# EAGLE design 3xCV (EAGLE 7.1.0)
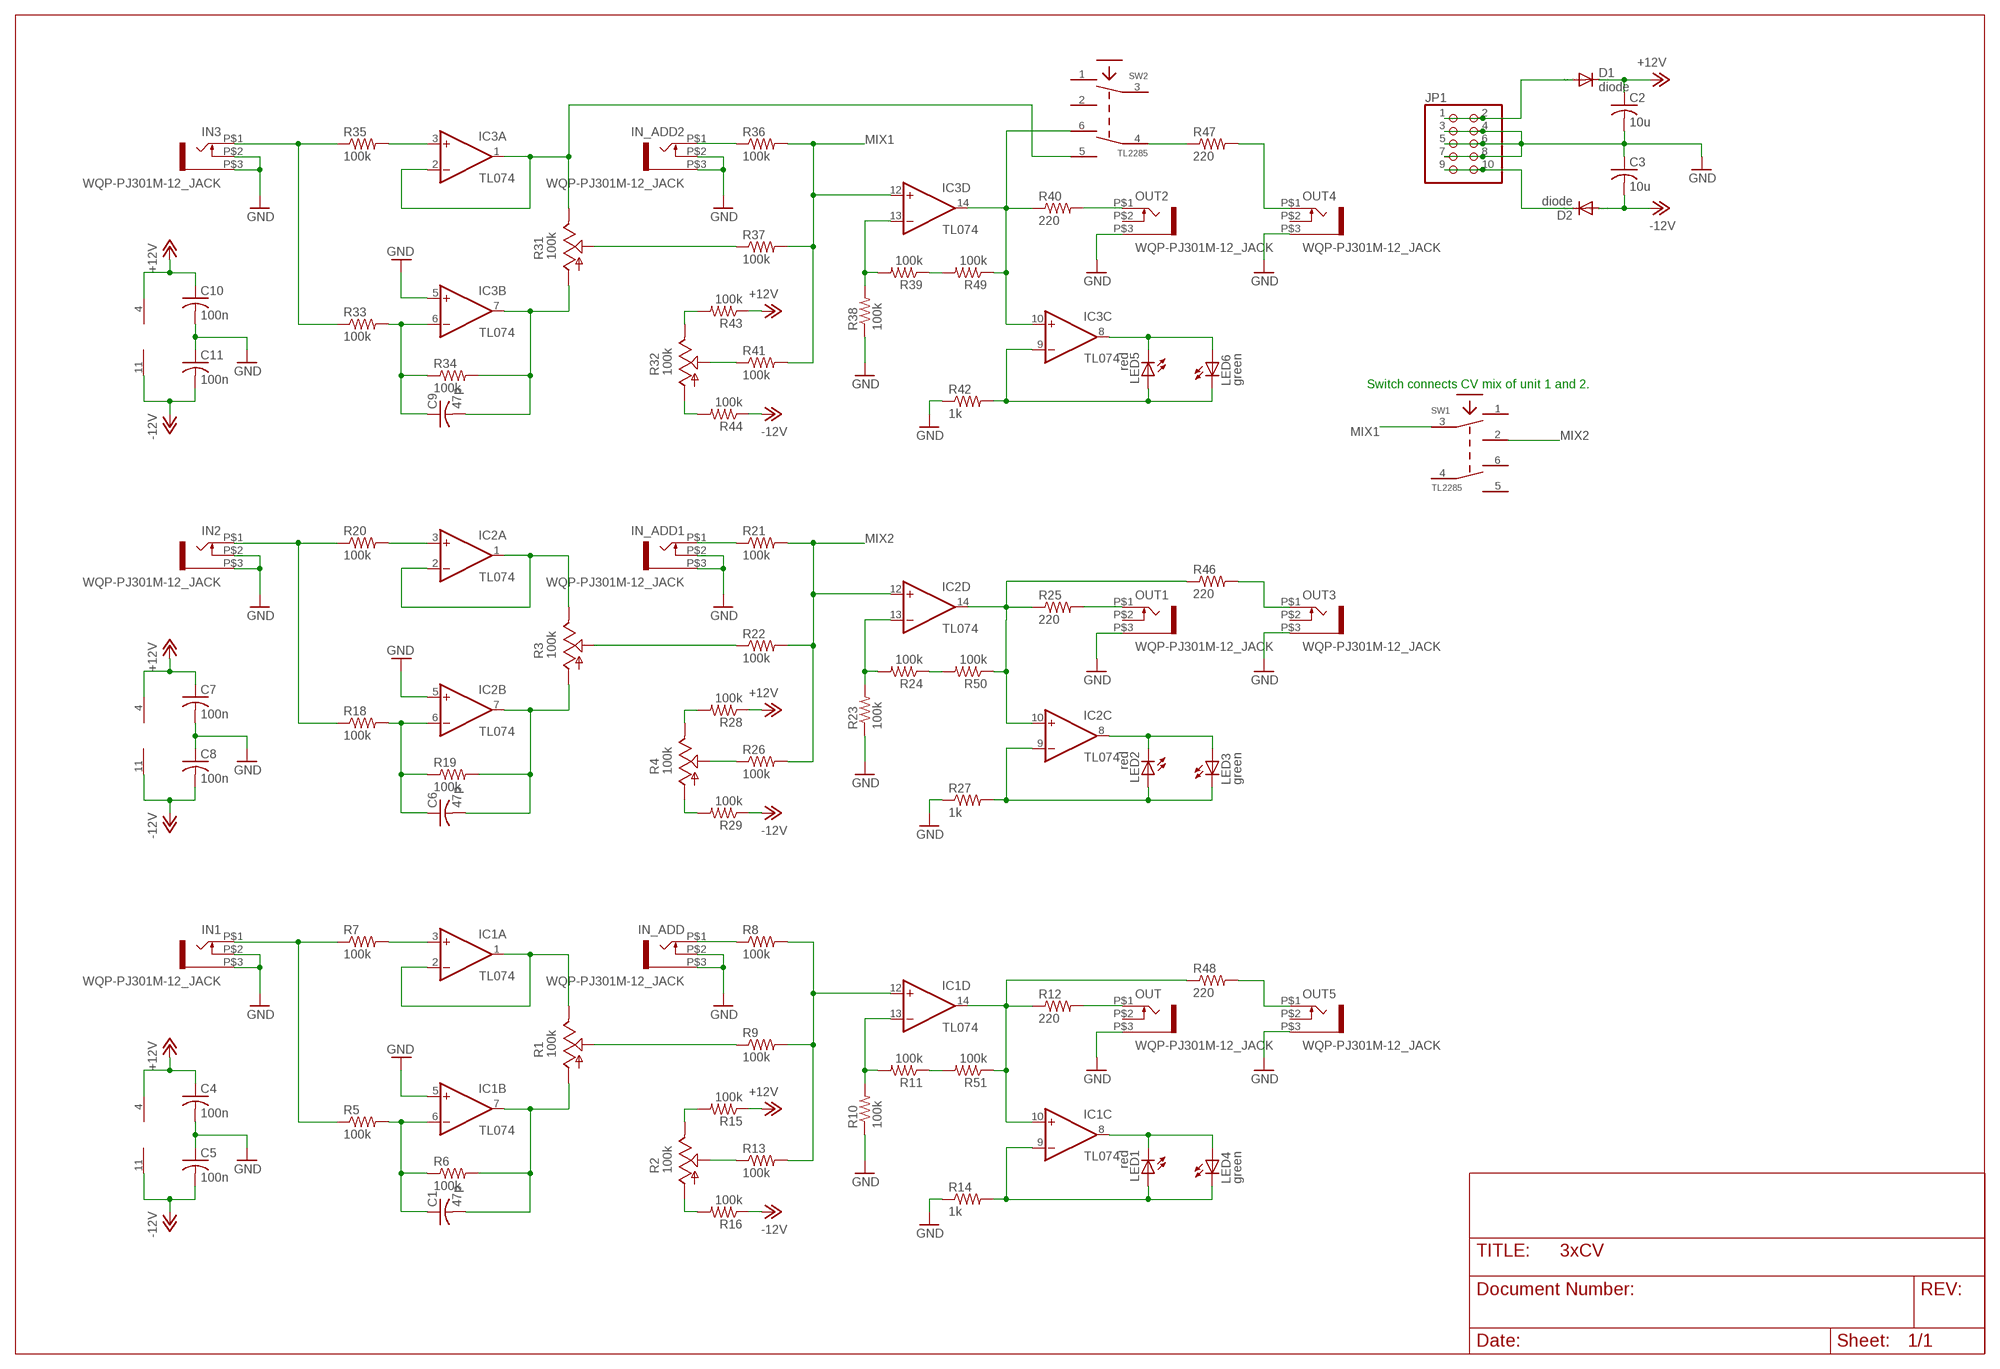
[diagram p0: schematic, sheet 1]

## Parts
C1  47p  C-USC0603  [C0603]
C2  10u  C-USC1206  [C1206]
C3  10u  C-USC1206  [C1206]
C4  100n  C-USC0603  [C0603]
C5  100n  C-USC0603  [C0603]
C6  47p  C-USC0603  [C0603]
C7  100n  C-USC0603  [C0603]
C8  100n  C-USC0603  [C0603]
C9  47p  C-USC0603  [C0603]
C10  100n  C-USC0603  [C0603]
C11  100n  C-USC0603  [C0603]
D1  diode  DIODE-DO214AA  [DO214AA]
D2  diode  DIODE-DO214AA  [DO214AA]
IC1  TL074  LM324D  [SO14]
IC2  TL074  LM324D  [SO14]
IC3  TL074  LM324D  [SO14]
IN1  WQP-PJ301M-12_JACK  [WQP-PJ301M-12_JACK]
IN2  WQP-PJ301M-12_JACK  [WQP-PJ301M-12_JACK]
IN3  WQP-PJ301M-12_JACK  [WQP-PJ301M-12_JACK]
IN_ADD  WQP-PJ301M-12_JACK  [WQP-PJ301M-12_JACK]
IN_ADD1  WQP-PJ301M-12_JACK  [WQP-PJ301M-12_JACK]
IN_ADD2  WQP-PJ301M-12_JACK  [WQP-PJ301M-12_JACK]
JP1  PINHD-2X5  [2X05]
LED1  red  LED3MM  [LED3MM]
LED2  red  LED3MM  [LED3MM]
LED3  green  LED3MM  [LED3MM]
LED4  green  LED3MM  [LED3MM]
LED5  red  LED3MM  [LED3MM]
LED6  green  LED3MM  [LED3MM]
OUT  WQP-PJ301M-12_JACK  [WQP-PJ301M-12_JACK]
OUT1  WQP-PJ301M-12_JACK  [WQP-PJ301M-12_JACK]
OUT2  WQP-PJ301M-12_JACK  [WQP-PJ301M-12_JACK]
OUT3  WQP-PJ301M-12_JACK  [WQP-PJ301M-12_JACK]
OUT4  WQP-PJ301M-12_JACK  [WQP-PJ301M-12_JACK]
OUT5  WQP-PJ301M-12_JACK  [WQP-PJ301M-12_JACK]
R1  100k  POT_USVERTICAL  [ALPS_POT_VERTICAL]
R2  100k  POT_USVERTICAL  [ALPS_POT_VERTICAL]
R3  100k  POT_USVERTICAL  [ALPS_POT_VERTICAL]
R4  100k  POT_USVERTICAL  [ALPS_POT_VERTICAL]
R5  100k  R-US_R0603  [R0603]
R6  100k  R-US_R0603  [R0603]
R7  100k  R-US_R0603  [R0603]
R8  100k  R-US_R0603  [R0603]
R9  100k  R-US_R0603  [R0603]
R10  100k  R-US_R0603  [R0603]
R11  100k  R-US_R0603  [R0603]
R12  220  R-US_R0603  [R0603]
R13  100k  R-US_R0603  [R0603]
R14  1k  R-US_R0603  [R0603]
R15  100k  R-US_R0603  [R0603]
R16  100k  R-US_R0603  [R0603]
R18  100k  R-US_R0603  [R0603]
R19  100k  R-US_R0603  [R0603]
R20  100k  R-US_R0603  [R0603]
R21  100k  R-US_R0603  [R0603]
R22  100k  R-US_R0603  [R0603]
R23  100k  R-US_R0603  [R0603]
R24  100k  R-US_R0603  [R0603]
R25  220  R-US_R0603  [R0603]
R26  100k  R-US_R0603  [R0603]
R27  1k  R-US_R0603  [R0603]
R28  100k  R-US_R0603  [R0603]
R29  100k  R-US_R0603  [R0603]
R31  100k  POT_USVERTICAL  [ALPS_POT_VERTICAL]
R32  100k  POT_USVERTICAL  [ALPS_POT_VERTICAL]
R33  100k  R-US_R0603  [R0603]
R34  100k  R-US_R0603  [R0603]
R35  100k  R-US_R0603  [R0603]
R36  100k  R-US_R0603  [R0603]
R37  100k  R-US_R0603  [R0603]
R38  100k  R-US_R0603  [R0603]
R39  100k  R-US_R0603  [R0603]
R40  220  R-US_R0603  [R0603]
R41  100k  R-US_R0603  [R0603]
R42  1k  R-US_R0603  [R0603]
R43  100k  R-US_R0603  [R0603]
R44  100k  R-US_R0603  [R0603]
R46  220  R-US_R0603  [R0603]
R47  220  R-US_R0603  [R0603]
R48  220  R-US_R0603  [R0603]
R49  100k  R-US_R0603  [R0603]
R50  100k  R-US_R0603  [R0603]
R51  100k  R-US_R0603  [R0603]
SW1  TL2285  [TL2285_PCB]
SW2  TL2285  [TL2285_PCB]

## Nets
+12V: C2.1 C4.1 C7.1 C10.1 D1.C IC1.4(P:V+) IC2.4(P:V+) IC3.4(P:V+) R15.1 R28.1 R43.1
-12V: C3.2 C5.2 C8.2 C11.2 D2.A IC1.11(P:V-) IC2.11(P:V-) IC3.11(P:V-) R16.1 R29.1 R44.1
GND: C2.2 C3.1 C4.2 C5.1 C7.2 C8.1 C10.2 C11.1 IC1.5(B:+IN) IC2.5(B:+IN) IC3.5(B:+IN) IN1.P$2 IN1.P$3 IN2.P$2 IN2.P$3 IN3.P$2 IN3.P$3 IN_ADD1.P$2 IN_ADD1.P$3 IN_ADD2.P$2 IN_ADD2.P$3 IN_ADD.P$2 IN_ADD.P$3 JP1.3 JP1.4 JP1.5 JP1.6 JP1.7 JP1.8 OUT1.P$3 OUT2.P$3 OUT3.P$3 OUT4.P$3 OUT5.P$3 OUT.P$3 R10.1 R14.1 R23.1 R27.1 R38.1 R42.1
MIX1: IC3.12(D:+IN) R36.2 R37.2 R41.2 SW1.3
MIX2: IC2.12(D:+IN) R21.2 R22.2 R26.2 SW1.2
N$1: IC1.9(C:-IN) LED1.A LED4.K(C) R14.2
N$2: IN1.P$1 R5.1 R7.1
N$3: C1.1 IC1.6(B:-IN) R5.2 R6.1
N$4: IC1.3(A:+IN) R7.2
N$5: IC1.1(A:OUT) IC1.2(A:-IN) R1.P$1(E)
N$6: OUT.P$1 R12.2
N$7: C1.2 IC1.7(B:OUT) R1.P$3(A) R6.2
N$8: R2.P$2(S) R13.1
N$9: R1.P$2(S) R9.1
N$10: IN_ADD.P$1 R8.1
N$11: IC1.8(C:OUT) LED1.K(C) LED4.A
N$12: IC1.12(D:+IN) R8.2 R9.2 R13.2
N$13: IC1.10(C:+IN) IC1.14(D:OUT) R12.1 R48.1 R51.1
N$14: IC1.13(D:-IN) R10.2 R11.2
N$15: R2.P$1(E) R15.2
N$16: R2.P$3(A) R16.2
N$17: D2.C JP1.9 JP1.10
N$18: R47.1 SW2.4
N$19: OUT3.P$1 R46.2
N$20: D1.A JP1.1 JP1.2
N$21: OUT4.P$1 R47.2
N$22: IN2.P$1 R18.1 R20.1
N$23: C6.1 IC2.6(B:-IN) R18.2 R19.1
N$24: IC2.3(A:+IN) R20.2
N$25: IC2.1(A:OUT) IC2.2(A:-IN) R3.P$1(E)
N$26: C6.2 IC2.7(B:OUT) R3.P$3(A) R19.2
N$27: R3.P$2(S) R22.1
N$28: IN_ADD1.P$1 R21.1
N$31: IC2.13(D:-IN) R23.2 R24.2
N$32: OUT1.P$1 R25.2
N$33: R4.P$2(S) R26.1
N$34: IC2.9(C:-IN) LED2.A LED3.K(C) R27.2
N$35: IC2.8(C:OUT) LED2.K(C) LED3.A
N$36: R4.P$1(E) R28.2
N$37: R4.P$3(A) R29.2
N$39: IN3.P$1 R33.1 R35.1
N$40: C9.1 IC3.6(B:-IN) R33.2 R34.1
N$41: IC3.3(A:+IN) R35.2
N$42: IC3.1(A:OUT) IC3.2(A:-IN) R31.P$1(E) SW2.5
N$43: C9.2 IC3.7(B:OUT) R31.P$3(A) R34.2
N$44: R31.P$2(S) R37.1
N$45: IN_ADD2.P$1 R36.1
N$47: IC3.10(C:+IN) IC3.14(D:OUT) R40.1 R49.1 SW2.6
N$48: IC3.13(D:-IN) R38.2 R39.2
N$49: OUT2.P$1 R40.2
N$50: R32.P$2(S) R41.1
N$51: IC3.9(C:-IN) LED5.A LED6.K(C) R42.2
N$52: IC3.8(C:OUT) LED5.K(C) LED6.A
N$53: R32.P$1(E) R43.2
N$54: R32.P$3(A) R44.2
N$56: OUT5.P$1 R48.2
N$57: IC2.10(C:+IN) IC2.14(D:OUT) R25.1 R46.1 R50.1
N$58: R11.1 R51.2
N$59: R24.1 R50.2
N$61: R39.1 R49.2
Unconnected: OUT1.P$2 OUT2.P$2 OUT3.P$2 OUT4.P$2 OUT5.P$2 OUT.P$2 SW1.1 SW1.4 SW1.5 SW1.6 SW2.1 SW2.2 SW2.3

## Notes on the sheet
- Switch connects CV mix of unit 1 and 2.

## Library data of the parts
C1-C11 = rcl:C-US: CAPACITOR, American symbol
D1 D2 = diode:DIODE-: DIODE
IC1-IC3 = linear:LM324: OP AMP
IN1-IN3 IN_ADD IN_ADD1 IN_ADD2 OUT OUT1-OUT5 = thonkiconn:WQP-PJ301M-12_JACK
JP1 = pinhead:PINHD-2X5: PIN HEADER
LED1-LED6 = led:LED: LED OSRAM: - CHIPLED LG R971, LG N971, LY N971, LG Q971, LY Q971, LO R971, LY R971 LH N974, LH R974 LS Q976, LO Q976, LY Q976 LO Q996 - Hyper CHIPLED LW Q18S LB Q993, LB Q99A, LB R99A - SideLED LS A670, LO A670, LY A670, LG A670, LP A670 LB A673, LV A673, LT A673, LW A673 LH A674 LY A675 LS A676, LA A676, LO A676, LY A676, LW A676 LS A679, LY A679, LG A679 - Hyper Micro SIDELED® LS Y876, LA Y876, LO Y876, LY Y876 LT Y87S - SmartLED LW L88C, LW L88S LB L89C, LB L89S, LG L890 LS L89K, LO L89K, LY L89K LS L896, LA L896, LO L896, LY L896 - TOPLED LS T670, LO T670, LY T670, LG T670, LP T670 LSG T670, LSP T670, LSY T670, LOP T670, LYG T670 LG T671, LOG T671, LSG T671 LB T673, LV T673, LT T673, LW T673 LH T674 LS T676, LA T676, LO T676, LY T676, LB T676, LH T676, LSB T676, LW T676 LB T67C, LV T67C, LT T67C, LS T67K, LO T67K, LY T67K, LW E67C LS E67B, LA E67B, LO E67B, LY E67B, LB E67C, LV E67C, LT E67C LW T67C LS T679, LY T679, LG T679 LS T770, LO T770, LY T770, LG T770, LP T770 LB T773, LV T773, LT T773, LW T773 LH T774 LS E675, LA E675, LY E675, LS T675 LS T776, LA T776, LO T776, LY T776, LB T776 LHGB T686 LT T68C, LB T68C - Hyper Mini TOPLED® LB M676 - Mini TOPLED Santana® LG M470 LS M47K, LO M47K, LY M47K Source: http://www.osram.convergy.de LUXEON: - LUMILED® LXK2-PW12-R00, LXK2-PW12-S00, LXK2-PW14-U00, LXK2-PW14-V00 LXK2-PM12-R00, LXK2-PM12-S00, LXK2-PM14-U00 LXK2-PE12-Q00, LXK2-PE12-R00, LXK2-PE12-S00, LXK2-PE14-T00, LXK2-PE14-U00 LXK2-PB12-K00, LXK2-PB12-L00, LXK2-PB12-M00, LXK2-PB14-N00, LXK2-PB14-P00, LXK2-PB14-Q00 LXK2-PR12-L00, LXK2-PR12-M00, LXK2-PR14-Q00, LXK2-PR14-R00 LXK2-PD12-Q00, LXK2-PD12-R00, LXK2-PD12-S00 LXK2-PH12-R00, LXK2-PH12-S00 LXK2-PL12-P00, LXK2-PL12-Q00, LXK2-PL12-R00 Source: www.luxeon.com KINGBRIGHT: KA-3528ASYC Source: www.kingbright.com
R1-R4 R31 R32 = pot-alps:POT_US
R5-R16 R18-R29 R33-R44 R46-R51 = rcl:R-US_: RESISTOR, American symbol
SW1 SW2 = lb_devs:TL2285: E-Switch TL2285 (PCB switch)

## Board
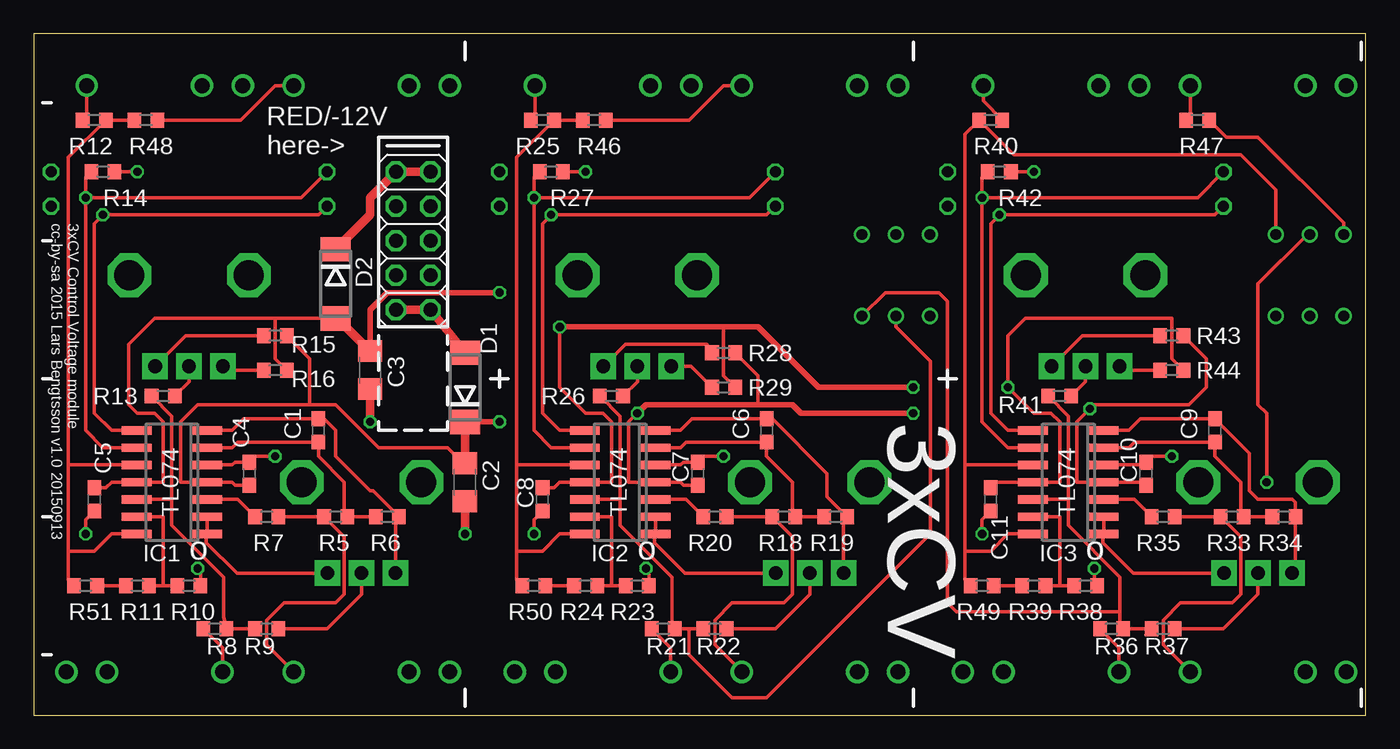
[diagram p1: board, top side]
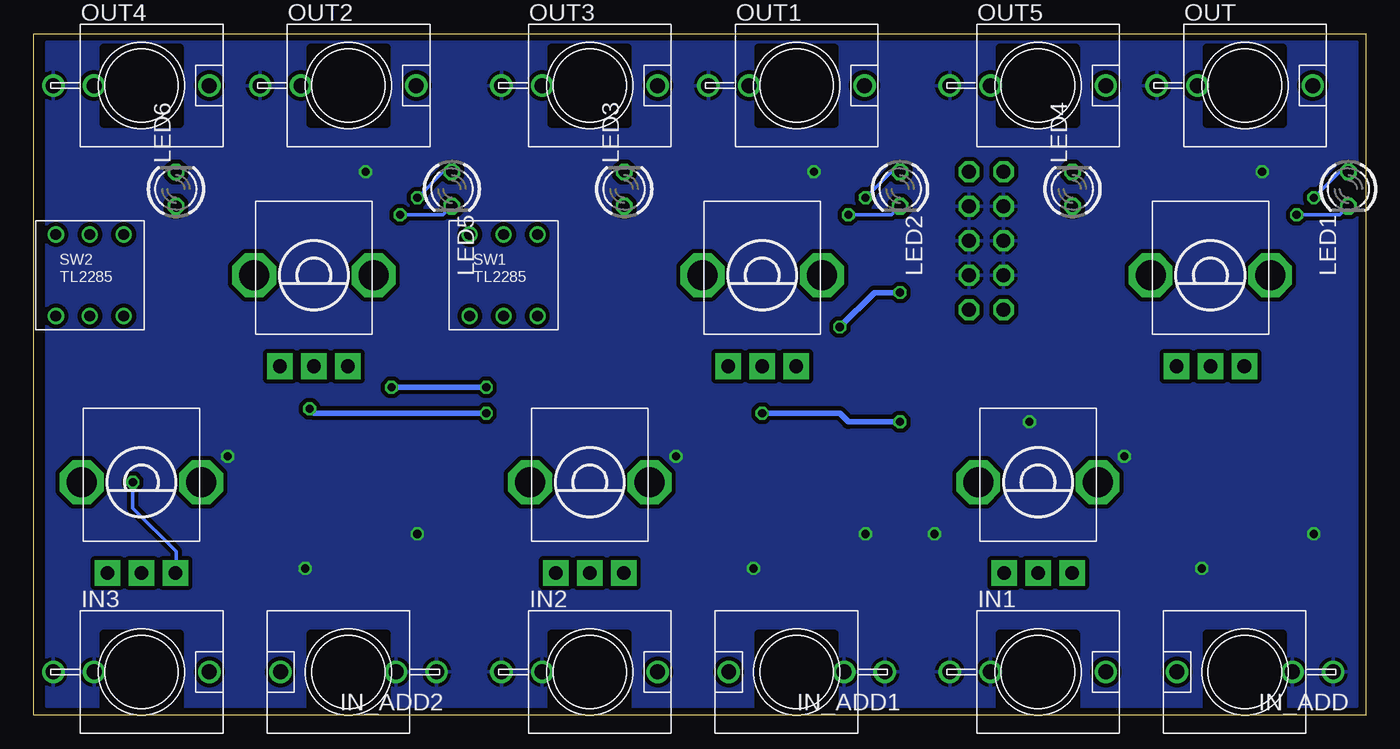
[diagram p2: board, bottom side, seen from below]

Size 98.09 x 50.16 mm. Coordinates in mm from the lower left corner, seen from the top.
Outline: 0,0 98.09,0 98.09,50.16 0,50.16 0,0
Copper layers (1*16): Top 0.0356mm / dielectric 1.5011mm / Bottom 0.0356mm
Design rules "LaenPCBOrder": minimum track width 6mil, minimum drill 13mil, track to track 6mil, track to pad 6mil, pad to pad 6mil, via to via 6mil, smd to smd 6mil, copper to edge 15mil, drill to drill 6mil, minimum pad ring 7mil, minimum via ring 7mil, stop-mask expansion 3mil, vias tented up to drill 0mil, thermal gap 10mil

### Footprints (pad centres in the part's own frame; a part is rotated, then mirrored left to right if it is on the bottom)
C0603 = smd 1.1 x 1: 1 -0.85,0; 2 0.85,0
C1206 = smd 1.6 x 1.8: 1 -1.4,0; 2 1.4,0
DO214AA = smd 1.8 x 2.2: A 2.55,0; C -2.55,0
SO14 = smd 0.6 x 2.2: 1 -3.81,-2.6; 2 -2.54,-2.6; 3 -1.27,-2.6; 4 0,-2.6; 5 1.27,-2.6; 6 2.54,-2.6; 7 3.81,-2.6; 8 3.81,2.6; 9 2.54,2.6; 10 1.27,2.6; 11 0,2.6; 12 -1.27,2.6; 13 -2.54,2.6; 14 -3.81,2.6
WQP-PJ301M-12_JACK = drill 1.1: P$1 0,5; P$2 0,-3.5; P$3 0,-6.5
2X05 = drill 1.016 octagon: 1 -5.08,-1.27; 2 -5.08,1.27; 3 -2.54,-1.27; 4 -2.54,1.27; 5 0,-1.27; 6 0,1.27; 7 2.54,-1.27; 8 2.54,1.27; 9 5.08,-1.27; 10 5.08,1.27
LED3MM = drill 0.813 octagon: A -1.27,0; K 1.27,0
ALPS_POT_VERTICAL = drill 1 pad 1.88 square: P$1 -2.5,6.7; P$2 0,6.7; P$3 2.5,6.7 | drill 2.2 pad 3.175 octagon: P$4 -4.4,0; P$5 4.4,0
R0603 = smd 1 x 1.1: 1 -0.85,0; 2 0.85,0
TL2285_PCB = drill 0.8: 1 -2.5,-3; 2 0,-3; 3 2.5,-3; 4 -2.5,3; 5 0,3; 6 2.5,3

### Placement (x,y rotation side)
C1  20.96,20.96 90 top
C2  31.75,17.14 270 top
C3  24.77,25.4 90 top
C4  15.88,17.78 90 top
C5  4.45,15.88 90 top
C6  53.97,20.96 90 top
C7  48.89,17.78 90 top
C8  37.46,15.88 90 top
C9  87,20.96 90 top
C10  81.92,17.78 90 top
C11  70.48,15.88 90 top
D1  31.75,24.13 90 top
D2  22.23,31.75 270 top
IC1  10.16,17.14 90 top
IC2  43.18,17.14 90 top
IC3  76.2,17.14 90 top
IN1  24.13,3.18 270 bottom
IN2  57.15,3.18 270 bottom
IN3  90.17,3.18 270 bottom
IN_ADD  8.89,3.18 90 bottom
IN_ADD1  41.91,3.18 90 bottom
IN_ADD2  74.93,3.18 90 bottom
JP1  27.94,34.92 90 top
LED1  1.27,38.73 270 bottom
LED2  34.29,38.73 270 bottom
LED3  54.61,38.73 90 bottom
LED4  21.59,38.73 90 bottom
LED5  67.31,38.73 270 bottom
LED6  87.63,38.73 90 bottom
OUT  8.89,46.36 270 bottom
OUT1  41.91,46.36 270 bottom
OUT2  74.93,46.36 270 bottom
OUT3  57.15,46.36 270 bottom
OUT4  90.17,46.36 270 bottom
OUT5  24.13,46.36 270 bottom
R1  24.13,17.14 180 bottom
R2  11.43,32.39 180 bottom
R3  57.15,17.14 180 bottom
R4  44.45,32.39 180 bottom
R5  22.23,14.61 0 top
R6  26.04,14.61 0 top
R7  17.14,14.61 180 top
R8  13.34,6.35 0 top
R9  17.14,6.35 180 top
R10  11.43,9.53 180 top
R11  7.62,9.53 0 top
R12  4.45,43.81 180 top
R13  9.53,23.5 180 top
R14  5.08,40 180 top
R15  17.78,27.94 180 top
R16  17.78,25.4 180 top
R18  55.24,14.61 0 top
R19  59.05,14.61 0 top
R20  50.16,14.61 180 top
R21  46.35,6.35 0 top
R22  50.16,6.35 180 top
R23  44.45,9.53 180 top
R24  40.64,9.53 0 top
R25  37.46,43.81 180 top
R26  42.54,23.5 180 top
R27  38.1,40 180 top
R28  50.8,26.67 180 top
R29  50.8,24.13 180 top
R31  90.17,17.14 180 bottom
R32  77.47,32.39 180 bottom
R33  88.27,14.61 0 top
R34  92.08,14.61 0 top
R35  83.19,14.61 180 top
R36  79.38,6.35 0 top
R37  83.19,6.35 180 top
R38  77.47,9.53 180 top
R39  73.66,9.53 0 top
R40  70.48,43.81 0 top
R41  75.56,23.5 180 top
R42  71.12,40 180 top
R43  83.82,27.94 180 top
R44  83.82,25.4 180 top
R46  41.27,43.81 0 top
R47  85.73,43.81 180 top
R48  8.26,43.81 0 top
R49  69.85,9.53 0 top
R50  36.83,9.53 0 top
R51  3.81,9.53 0 top
SW1  63.5,32.39 0 bottom
SW2  93.98,32.39 0 bottom

### Tracks (layer width: path | path; a pad name or v marks a point on that pad's centre or on a via)
+12V  (via drill 0.6)
  Top 0.254: 31.13,20.96 D1.C | 20.32,22.86 12.07,22.86 10.79,21.59 10.79,17.14 IC1.4 14.61,17.14 14.82,16.93 C4.1 | 20.32,22.86 22.23,22.86 25.4,19.68 30.48,19.68 31.11,19.05 31.75,19.05 | C7.1 47.84,16.93 47.62,17.14 IC2.4 43.81,17.14 43.81,21.59 v44.45,22.23 | C10.1 81.7,17.14 IC3.4 76.84,17.14 76.84,21.59 v77.79,22.54 78.11,22.86 85.09,22.86 86.36,24.13 86.36,26.25 R43.1 | 20.32,22.86 20.32,26.25 R15.1 | R28.1 53.34,24.98 53.34,22.86
  Top 0.406: D1.C 33.64,21.58 v34.29,21.59 | v44.45,22.23 45.08,22.86 53.34,22.86 55.88,22.86 56.51,22.23 v64.77,22.23
  Top 0.61: D1.C 31.75,19.05 C2.1
  Bottom 0.406: v34.29,21.59 38.1,21.59 38.73,22.23 v44.45,22.23 | v64.77,22.23 77.47,22.23 v77.79,22.54
-12V  (via drill 0.6)
  Top 0.254: C5.2 5.29,16.73 5.71,17.14 IC1.11 9.53,17.14 9.53,21.59 8.89,22.23 7.62,22.23 6.99,22.86 6.99,27.31 8.89,29.21 17.78,29.21 | 17.78,29.21 17.78,26.25 R16.1 | C8.2 38.31,16.73 38.73,17.14 IC2.11 42.54,17.14 42.54,21.59 41.91,22.23 40.64,22.23 38.73,24.13 v38.73,28.57 | 50.8,28.57 50.8,24.98 R29.1 | C11.2 70.91,17.14 IC3.11 75.56,17.14 75.56,21.59 74.93,22.23 73.66,22.23 v71.76,24.13 71.76,27.94 73.03,29.21 83.82,29.21 83.82,26.25 R44.1 | 17.78,29.21 22.21,29.21 D2.A
  Top 0.406: v38.73,28.57 50.8,28.57 53.34,28.57 57.78,24.13 v64.77,24.13 | v34.29,31.11 26.04,31.11 24.77,29.85 C3.2
  Top 0.61: D2.A 22.37,29.2 C3.2
  Bottom 0.406: v34.29,31.11 36.2,31.11 v38.73,28.57 | v64.77,24.13 v71.76,24.13
GND  (via drill 0.6)
  Top 0.254: v3.81,13.34 3.81,14.39 C5.1 | R10.1 12.28,10.38 v12.07,10.8 | IC1.5 14.61,18.41 14.82,18.63 C4.2 16.3,19.05 v17.78,19.05 | v50.8,19.05 49.31,19.05 C7.2 47.84,18.63 47.62,18.41 IC2.5 | v36.83,13.34 36.83,14.39 C8.1 | R23.1 45.3,10.38 v45.08,10.8 | v83.82,19.05 82.34,19.05 C10.2 81.7,18.41 IC3.5 | v78.11,10.8 78.11,9.31 R38.1 | v69.85,13.34 69.85,14.39 C11.1 | v73.66,40 R42.1 | v40.64,40 R27.1 | v7.62,40 R14.1
  Top 0.61: v31.75,13.34 C2.2 | v24.77,21.59 C3.1
  pour Bottom (isolate 0.305): 0.64,49.53 97.16,49.53 97.16,0.63 0.64,0.63
MIX1
  Top 0.254: 76.2,15.88 IC3.12 74.3,15.88 | 76.2,15.88 76.2,13.97 80.01,10.16 80.01,7.62 | 80.01,7.62 80.01,6.56 R36.2 R37.2 81.92,5.93 | 76.2,15.88 76.2,22.01 R41.2 | SW1.3 62.73,31.11 66.67,31.11 67.31,30.48 67.31,8.26 67.95,7.62 80.01,7.62
MIX2
  Top 0.254: IC2.12 43.18,15.88 | 43.18,15.88 43.18,22.01 R26.2 | 43.18,15.88 43.18,13.97 46.99,10.16 46.99,6.56 R21.2 48.26,6.35 | R22.2 48.26,6.35 | 48.26,6.35 48.26,4.45 51.43,1.27 53.97,1.27 66.04,13.34 66.04,26.04 63.5,28.57 SW1.2
N$1  (via drill 0.6)
  Top 0.254: IC1.9 5.08,19.68 3.81,20.96 v3.81,38.1 | v3.81,38.1 19.68,38.1 LED4.K | v3.81,38.1 3.81,39.58 R14.2
  Bottom 0.254: v3.81,38.1 1.9,40 LED1.A
N$2
  Top 0.254: R7.1 R5.1 22.86,13.12 22.86,8.89 22.23,8.26 18.41,8.26 17.14,6.98 17.14,5.16 IN1.P$1
N$3
  Top 0.254: IC1.6 14.61,19.68 15.03,20.11 C1.1 20.96,19.05 22.86,17.14 22.86,14.82 R5.2 R6.1
N$4
  Top 0.254: IC1.3 15.03,15.88 R7.2
N$5
  Top 0.254: IC1.2 IC1.1 12.7,13.27 12.7,12.7 14.96,10.45 R1.P$1
N$6
  Top 0.254: OUT.P$1 3.89,44.11 R12.2
N$7
  Top 0.254: IC1.7 14.61,20.96 15.46,21.8 C1.2 21.38,21.8 22.23,20.96 22.23,19.05 24.77,16.51 24.98,16.51 R6.2 26.63,14.35 R1.P$3
N$8
  Top 0.254: R2.P$2 11.43,24.55 R13.1
N$9
  Top 0.254: R1.P$2 24.13,8.89 21.59,6.35 R9.1
N$10
  Top 0.254: IN_ADD.P$1 13.89,4.95 R8.1
N$11  (via drill 0.6)
  Top 0.254: IC1.8 5.71,20.96 4.45,22.23 4.45,36.19 v5.08,36.83 20.96,36.83 LED4.A
  Bottom 0.254: LED1.K 1.9,36.83 v5.08,36.83
N$12
  Top 0.254: 10.16,15.88 IC1.12 7.62,15.88 | 10.16,15.88 10.16,13.97 13.97,10.16 13.97,7.2 R8.2 R9.2 | 10.16,15.88 10.16,22.01 R13.2
N$13
  Top 0.254: IC1.14 5.71,13.34 4.45,12.07 2.54,12.07 | 2.54,12.07 2.54,9.95 R51.1 | 2.54,12.07 2.54,18.41 | 2.54,18.41 IC1.10 | 2.54,18.41 2.54,41.06 R12.1 R48.1
N$14
  Top 0.254: R10.2 9.53,9.53 | 9.53,9.53 R11.2 | IC1.13 9.53,14.61 9.53,9.53
N$15
  Top 0.254: R15.2 11.19,27.94 R2.P$1
N$16
  Top 0.254: R16.2 14.21,25.4 R2.P$3
N$17
  Top 0.61: JP1.9 JP1.10 24.77,38.1 24.77,36.84 D2.C
N$18
  Top 0.254: SW2.4 96.48,36.23 90.17,42.55 87.84,42.55 R47.1
N$19
  Top 0.254: OUT3.P$1 50.8,46.36 48.26,43.81 R46.2
N$20
  Top 0.61: JP1.2 JP1.1 D1.A
N$21
  Top 0.254: OUT4.P$1 85.17,44.11 R47.2
N$22
  Top 0.254: R20.1 R18.1 55.88,13.12 55.88,8.89 55.24,8.26 51.43,8.26 50.16,6.98 50.16,5.16 IN2.P$1
N$23
  Top 0.254: IC2.6 47.62,19.68 48.04,20.11 C6.1 53.97,19.05 55.88,17.14 55.88,14.82 R18.2 R19.1
N$24
  Top 0.254: IC2.3 48.04,15.88 R20.2
N$25
  Top 0.254: IC2.2 IC2.1 45.72,13.27 45.72,12.7 47.97,10.45 R3.P$1
N$26
  Top 0.254: IC2.7 47.62,20.96 48.47,21.8 C6.2 54.39,21.8 58.42,17.78 58.42,16.09 R19.2 59.65,14.35 R3.P$3
N$27
  Top 0.254: R3.P$2 57.15,8.89 54.61,6.35 R22.1
N$28
  Top 0.254: IN_ADD1.P$1 46.91,4.95 R21.1
N$31
  Top 0.254: R23.2 42.54,9.53 | 42.54,9.53 R24.2 | IC2.13 42.54,14.61 42.54,9.53
N$32
  Top 0.254: OUT1.P$1 36.91,44.11 R25.2
N$33
  Top 0.254: R4.P$2 44.45,24.55 R26.1
N$34  (via drill 0.6)
  Top 0.254: IC2.9 38.1,19.68 36.83,20.96 v36.83,38.1 | LED3.K 52.7,38.1 v36.83,38.1 | v36.83,38.1 36.83,39.58 R27.2
  Bottom 0.254: v36.83,38.1 34.92,40 LED2.A
N$35  (via drill 0.6)
  Top 0.254: IC2.8 38.73,20.96 37.46,22.23 37.46,36.19 v38.1,36.83 53.97,36.83 LED3.A
  Bottom 0.254: v38.1,36.83 34.92,36.83 LED2.K
N$36
  Top 0.254: R28.2 49.53,27.31 43.57,27.31 R4.P$1
N$37
  Top 0.254: R4.P$3 48.39,25.68 R29.2
N$39
  Top 0.254: R35.1 R33.1 88.9,13.12 88.9,8.89 88.27,8.26 84.45,8.26 83.19,6.98 83.19,5.16 IN3.P$1
N$40
  Top 0.254: IC3.6 80.65,19.68 81.06,20.11 C9.1 87,19.05 88.9,17.14 88.9,14.82 R33.2 R34.1
N$41
  Top 0.254: IC3.3 81.06,15.88 R35.2
N$42  (via drill 0.6)
  Top 0.254: IC3.2 IC3.1 78.74,13.27 78.74,12.7 81,10.45 R31.P$1 | SW2.5 93.81,35.39 90.17,31.75 90.17,22.86 90.81,22.23 v90.81,17.14
  Bottom 0.254: v90.81,17.14 90.81,15.24 87.63,12.07 87.63,10.48 R31.P$1
N$43
  Top 0.254: IC3.7 80.65,20.96 81.5,21.8 C9.2 89.54,19.27 89.54,16.51 90.17,15.88 92.71,15.88 92.92,15.66 R34.2 92.92,10.7 R31.P$3
N$44
  Top 0.254: R31.P$2 90.17,8.89 87.63,6.35 R37.1
N$45
  Top 0.254: IN_ADD2.P$1 79.93,4.95 R36.1
N$47
  Top 0.254: IC3.14 71.76,13.34 70.48,12.07 68.58,12.07 | IC3.10 68.58,18.41 | 68.58,18.41 68.58,12.07 | 68.58,12.07 68.58,9.95 R49.1 | 68.58,18.41 68.58,42.76 R40.1 72.17,41.28 88.9,41.28 91.48,38.69 SW2.6
N$48
  Top 0.254: R38.2 75.56,9.53 | 75.56,9.53 R39.2 | IC3.13 75.56,14.61 75.56,9.53
N$49
  Top 0.254: OUT2.P$1 69.93,45.22 R40.2
N$50
  Top 0.254: R32.P$2 77.47,24.55 R41.1
N$51  (via drill 0.6)
  Top 0.254: IC3.9 71.76,19.68 69.85,21.59 v69.85,38.1 | LED6.K 85.73,38.1 v69.85,38.1 | v69.85,38.1 69.85,39.58 R42.2
  Bottom 0.254: v69.85,38.1 67.95,40 LED5.A
N$52  (via drill 0.6)
  Top 0.254: IC3.8 71.76,20.96 70.48,22.23 70.48,36.19 v71.12,36.83 87,36.83 LED6.A
  Bottom 0.254: v71.12,36.83 67.95,36.83 LED5.K
N$53
  Top 0.254: R43.2 77.23,27.94 R32.P$1
N$54
  Top 0.254: 83.19,25.4 R44.2 80.26,25.4 R32.P$3
N$56
  Top 0.254: OUT5.P$1 17.78,46.36 15.24,43.81 R48.2
N$57
  Top 0.254: IC2.14 38.73,13.34 37.46,12.07 35.56,12.07 | 35.56,12.07 35.56,9.95 R50.1 | IC2.10 35.56,18.41 | 35.56,18.41 35.56,12.07 | 35.56,18.41 35.56,41.06 R25.1 R46.1
N$58
  Top 0.254: R11.1 R51.2
N$59
  Top 0.254: R24.1 R50.2
N$61
  Top 0.254: R39.1 R49.2

### Text on the board
tNames: RED/-12V / here-> | 3xCV Control Voltage module / cc-by-sa 2015 Lars Bengtsson v1.0 20150913 | 3xCV | o | o | o